# EAGLE design FX-NVBMP_rev_A (EAGLE 9.6.2)
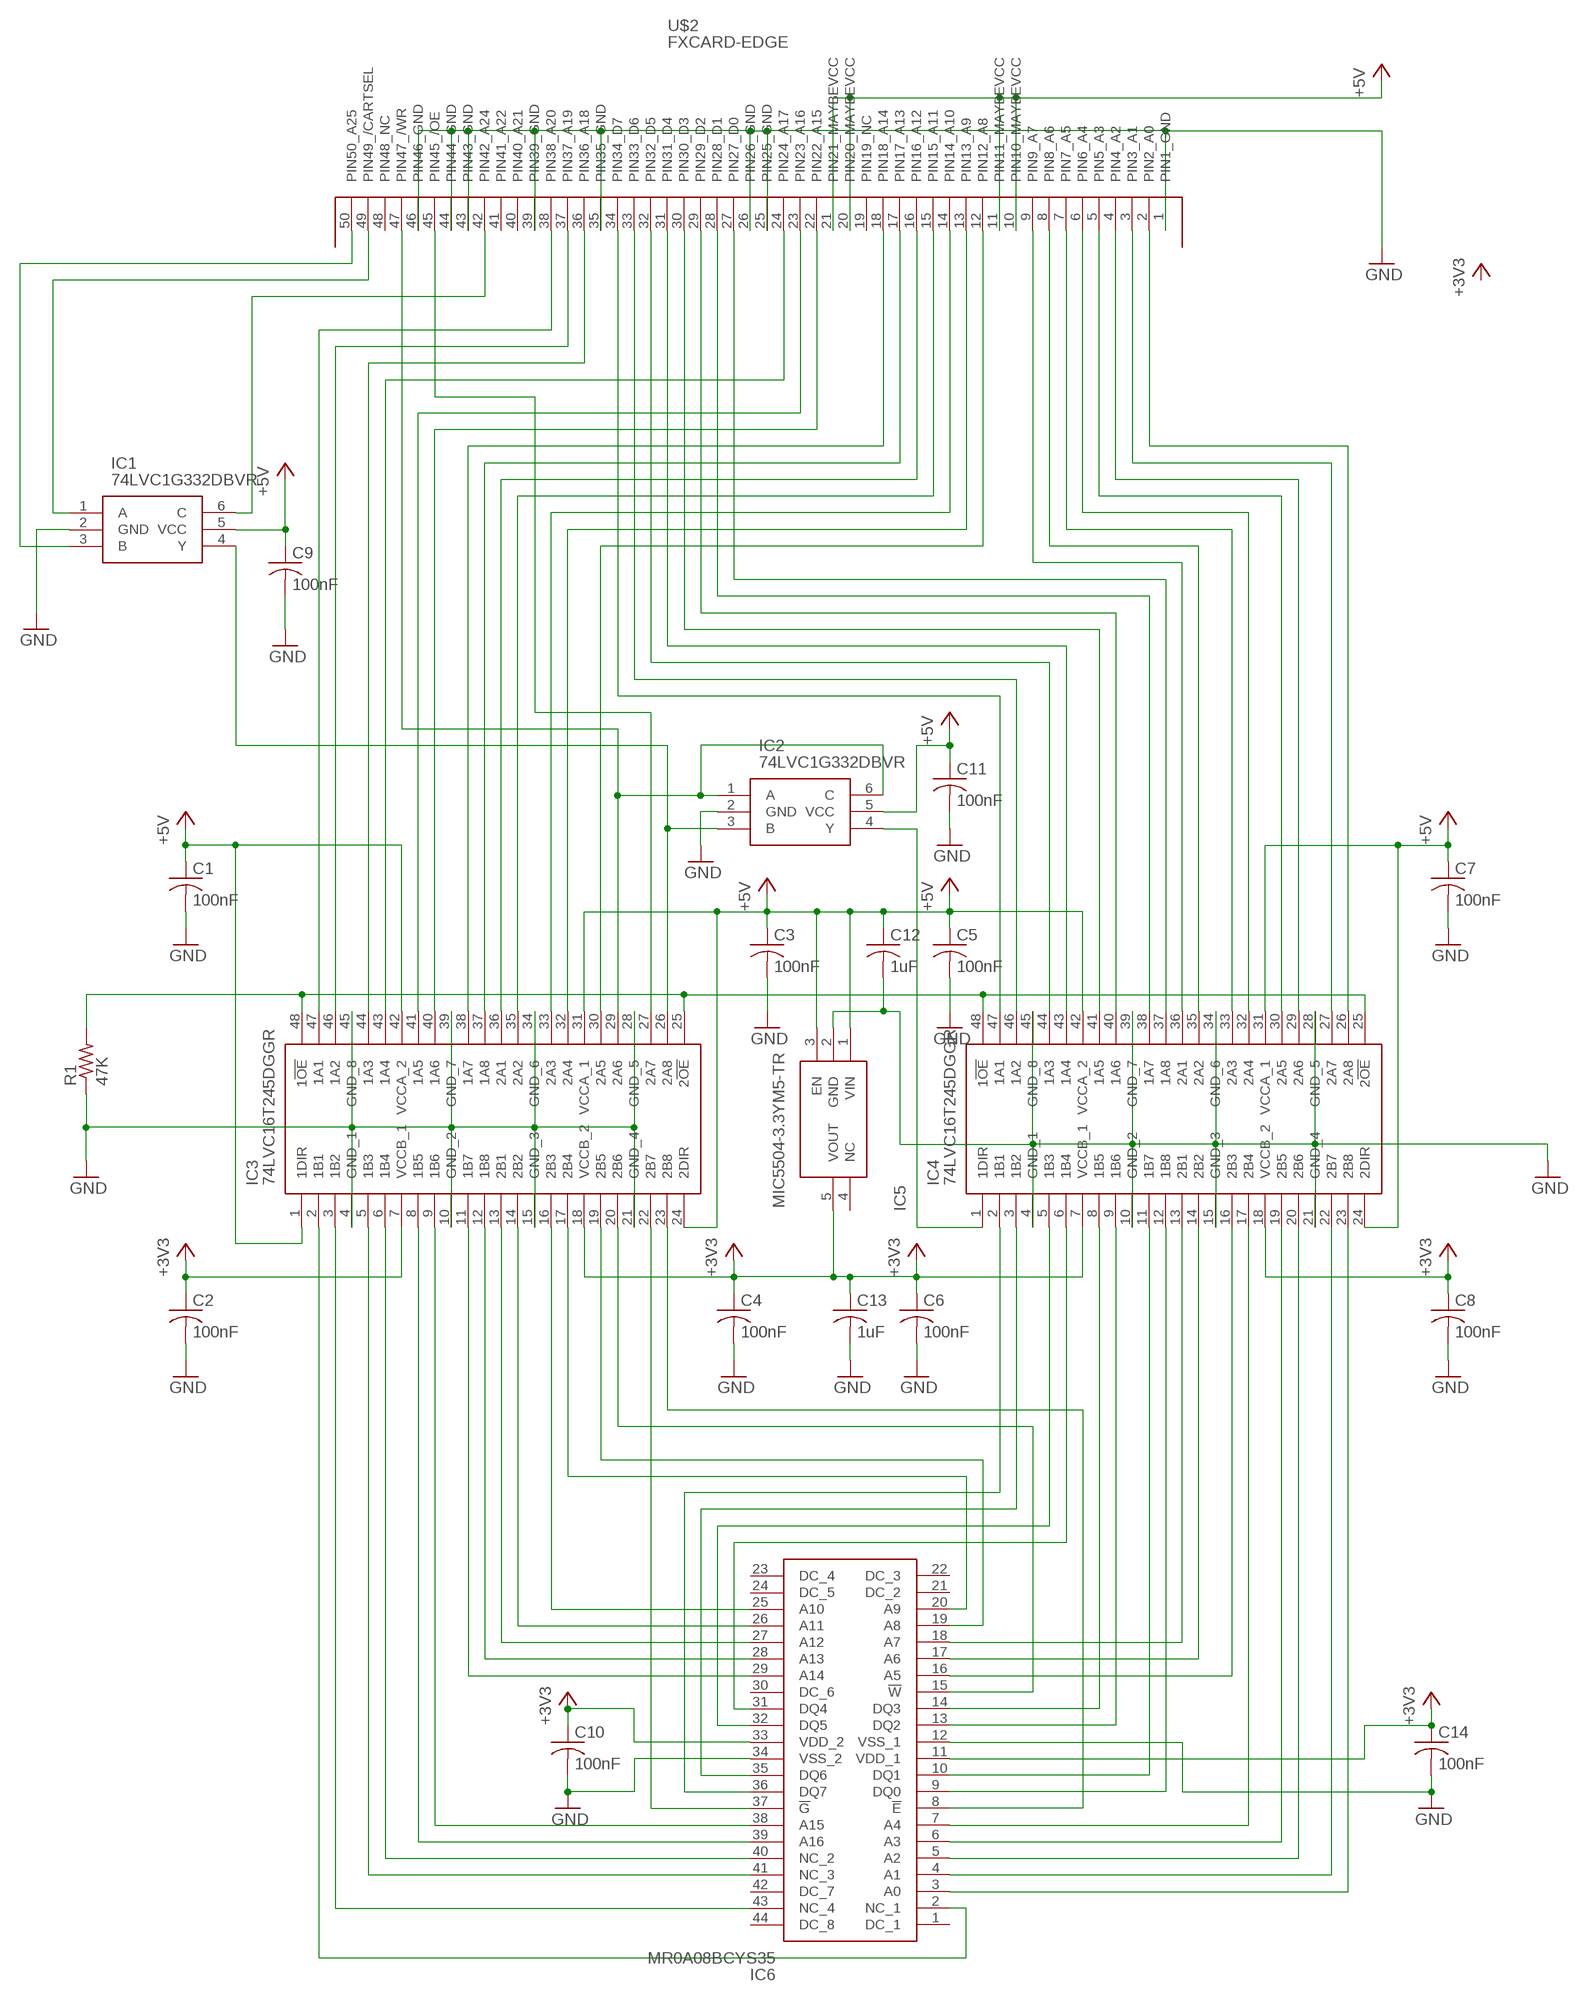
[diagram p0: schematic, sheet 1]

## Parts
C1  100nF  C-USC0402  [C0402]
C2  100nF  C-USC0402  [C0402]
C3  100nF  C-USC0402  [C0402]
C4  100nF  C-USC0402  [C0402]
C5  100nF  C-USC0402  [C0402]
C6  100nF  C-USC0402  [C0402]
C7  100nF  C-USC0402  [C0402]
C8  100nF  C-USC0402  [C0402]
C9  100nF  C-USC0402  [C0402]
C10  100nF  C-USC0402  [C0402]
C11  100nF  C-USC0402  [C0402]
C12  1uF  C-USC0402  [C0402]
C13  1uF  C-USC0402  [C0402]
C14  100nF  C-USC0402  [C0402]
IC1  74LVC1G332DBVR  [SOT95P280X145-6N]
IC2  74LVC1G332DBVR  [SOT95P280X145-6N]
IC3  74LVC16T245DGGR  [SOP50P810X120-48N]
IC4  74LVC16T245DGGR  [SOP50P810X120-48N]
IC5  MIC5504-3.3YM5-TR  [SOT95P280X145-5N]
IC6  MR0A08BCYS35  [SOP80P1176X120-44N]
R1  47K  R-US_R0402  [R0402]
U$2  FXCARD-EDGE  [FXCARD-EDGE]

## Nets
+3V3: C2.1 C4.1 C6.1 C8.1 C10.1 C13.1 C14.1 IC3.7(VCCB_1) IC3.18(VCCB_2) IC4.7(VCCB_1) IC4.18(VCCB_2) IC5.5(VOUT) IC6.11(VDD_1) IC6.33(VDD_2)
+5V: C1.1 C3.1 C5.1 C7.1 C9.1 C11.1 C12.1 IC1.5(VCC) IC2.5(VCC) IC3.1(1DIR) IC3.24(2DIR) IC3.31(VCCA_1) IC3.42(VCCA_2) IC4.24(2DIR) IC4.31(VCCA_1) IC4.42(VCCA_2) IC5.1(VIN) IC5.3(EN) U$2.10(PIN10_MAYBEVCC) U$2.11(PIN11_MAYBEVCC) U$2.20(PIN20_MAYBEVCC) U$2.21(PIN21_MAYBEVCC)
GND: C1.2 C2.2 C3.2 C4.2 C5.2 C6.2 C7.2 C8.2 C9.2 C10.2 C11.2 C12.2 C13.2 C14.2 IC1.2(GND) IC2.2(GND) IC3.4(GND_1) IC3.10(GND_2) IC3.15(GND_3) IC3.21(GND_4) IC3.28(GND_5) IC3.34(GND_6) IC3.39(GND_7) IC3.45(GND_8) IC4.4(GND_1) IC4.10(GND_2) IC4.15(GND_3) IC4.21(GND_4) IC4.28(GND_5) IC4.34(GND_6) IC4.39(GND_7) IC4.45(GND_8) IC5.2(GND) IC6.12(VSS_1) IC6.34(VSS_2) R1.1 U$2.1(PIN1_GND) U$2.25(PIN25_GND) U$2.26(PIN26_GND) U$2.35(PIN35_GND) U$2.39(PIN39_GND) U$2.43(PIN43_GND) U$2.44(PIN44_GND) U$2.46(PIN46_GND)
N$1: IC4.37(1A8) U$2.27(PIN27_D0)
N$2: IC4.38(1A7) U$2.28(PIN28_D1)
N$3: IC4.40(1A6) U$2.29(PIN29_D2)
N$4: IC4.41(1A5) U$2.30(PIN30_D3)
N$5: IC4.43(1A4) U$2.31(PIN31_D4)
N$6: IC4.44(1A3) U$2.32(PIN32_D5)
N$7: IC4.46(1A2) U$2.33(PIN33_D6)
N$8: IC4.47(1A1) U$2.34(PIN34_D7)
N$9: IC4.26(2A8) U$2.2(PIN2_A0)
N$10: IC4.27(2A7) U$2.3(PIN3_A1)
N$11: IC4.29(2A6) U$2.4(PIN4_A2)
N$12: IC4.30(2A5) U$2.5(PIN5_A3)
N$13: IC4.33(2A3) U$2.7(PIN7_A5)
N$14: IC3.43(1A4) U$2.24(PIN24_A17)
N$15: IC4.35(2A2) U$2.8(PIN8_A6)
N$16: IC4.36(2A1) U$2.9(PIN9_A7)
N$17: IC4.32(2A4) U$2.6(PIN6_A4)
N$18: IC3.44(1A3) U$2.36(PIN36_A18)
N$19: IC3.46(1A2) U$2.37(PIN37_A19)
N$20: IC3.47(1A1) U$2.38(PIN38_A20)
N$21: IC1.4(Y) IC2.3(B) IC3.26(2A8)
N$22: IC3.25(2!OE) IC3.48(1!OE) IC4.25(2!OE) IC4.48(1!OE) R1.2
N$23: IC4.23(2B8) IC6.3(A0)
N$24: IC4.22(2B7) IC6.4(A1)
N$25: IC4.20(2B6) IC6.5(A2)
N$26: IC2.4(Y) IC4.1(1DIR)
N$27: IC4.19(2B5) IC6.6(A3)
N$28: IC4.17(2B4) IC6.7(A4)
N$29: IC4.16(2B3) IC6.16(A5)
N$30: IC4.14(2B2) IC6.17(A6)
N$31: IC4.13(2B1) IC6.18(A7)
N$32: IC4.12(1B8) IC6.9(DQ0)
N$33: IC3.30(2A5) U$2.12(PIN12_A8)
N$34: IC3.32(2A4) U$2.13(PIN13_A9)
N$35: IC3.33(2A3) U$2.14(PIN14_A10)
N$36: IC3.35(2A2) U$2.15(PIN15_A11)
N$37: IC3.36(2A1) U$2.16(PIN16_A12)
N$38: IC3.37(1A8) U$2.17(PIN17_A13)
N$39: IC3.38(1A7) U$2.18(PIN18_A14)
N$40: IC3.40(1A6) U$2.22(PIN22_A15)
N$41: IC3.41(1A5) U$2.23(PIN23_A16)
N$42: IC2.1(A) IC2.6(C) IC3.29(2A6) U$2.47(PIN47_/WR)
N$43: IC3.27(2A7) U$2.45(PIN45_/OE)
N$44: IC1.3(B) U$2.50(PIN50_A25)
N$45: IC1.1(A) U$2.49(PIN49_/CARTSEL)
N$46: IC1.6(C) U$2.42(PIN42_A24)
N$47: IC4.11(1B7) IC6.10(DQ1)
N$48: IC4.9(1B6) IC6.13(DQ2)
N$49: IC4.8(1B5) IC6.14(DQ3)
N$50: IC4.6(1B4) IC6.31(DQ4)
N$51: IC4.5(1B3) IC6.32(DQ5)
N$52: IC4.3(1B2) IC6.35(DQ6)
N$53: IC4.2(1B1) IC6.36(DQ7)
N$54: IC3.19(2B5) IC6.19(A8)
N$55: IC3.17(2B4) IC6.20(A9)
N$56: IC3.16(2B3) IC6.25(A10)
N$57: IC3.14(2B2) IC6.26(A11)
N$58: IC3.13(2B1) IC6.27(A12)
N$59: IC3.12(1B8) IC6.28(A13)
N$60: IC3.11(1B7) IC6.29(A14)
N$61: IC3.9(1B6) IC6.38(A15)
N$62: IC3.8(1B5) IC6.39(A16)
N$63: IC3.6(1B4) IC6.40(NC_2)
N$64: IC3.5(1B3) IC6.41(NC_3)
N$65: IC3.3(1B2) IC6.43(NC_4)
N$66: IC3.2(1B1) IC6.2(NC_1)
N$67: IC3.20(2B6) IC6.15(!W)
N$68: IC3.23(2B8) IC6.8(!E)
N$69: IC3.22(2B7) IC6.37(!G)
Unconnected: IC5.4(NC) IC6.1(DC_1) IC6.21(DC_2) IC6.22(DC_3) IC6.23(DC_4) IC6.24(DC_5) IC6.30(DC_6) IC6.42(DC_7) IC6.44(DC_8) U$2.19(PIN19_NC) U$2.40(PIN40_A21) U$2.41(PIN41_A22) U$2.48(PIN48_NC)

## Library data of the parts
C1-C14 = PC-Engine0402:C-US: CAPACITOR, American symbol
IC1 IC2 = PC-Engine:74LVC1G332DBVR: Texas Instruments 74LVC1G332DBVR, 3-Input OR Logic Gate, 1.65 5.5 V, 6-Pin SOT-23 Source: Datasheet <http://www.ti.com/general/docs/suppproductinfo.tsp?distId=26&gotoUrl=http://www.ti.com/lit/gpn/sn74lvc1g332>; DESCRIPTION: Texas Instruments 74LVC1G332DBVR, 3-Input OR Logic Gate, 1.65 5.5 V, 6-Pin SOT-23; HEIGHT: 1.45mm; MANUFACTURER_NAME: Texas Instruments; MANUFACTURER_PART_NUMBER: 74LVC1G332DBVR
IC3 IC4 = PC-Engine:74LVC16T245DGGR: Texas Instruments 74LVC16T245DGGR, Dual, Bus Transceiver, 16-Bit Non-Inverting LVTTL, 1.65 5.5 V, 48-Pin TSSOP Source: Datasheet <https://www.ti.com/lit/ds/symlink/sn74lvc16t245.pdf?ts=1617777001037&ref_url=https%3A%2F%2Fwww.google.com%2F>; DESCRIPTION: Texas Instruments 74LVC16T245DGGR, Dual, Bus Transceiver, 16-Bit Non-Inverting LVTTL, 1.65 5.5 V, 48-Pin TSSOP; HEIGHT: 1.2mm; MANUFACTURER_NAME: Texas Instruments; MANUFACTURER_PART_NUMBER: 74LVC16T245DGGR
IC5 = PC-Engine:MIC5504-3.3YM5-TR: MICROCHIP - MIC5504-3.3YM5-TR - LDO VOLT REG, 0.3A, 3.3V, SOT-23-5 Source: Datasheet <https://componentsearchengine.com/Datasheets/2/MIC5504-3.3YM5-TR.pdf>; ARROW_PART_NUMBER: MIC5504-3.3YM5-TR; ARROW_PRICE-STOCK: https://www.arrow.com/en/products/mic5504-3.3ym5-tr/microchip-technology?region=nac; DESCRIPTION: MICROCHIP - MIC5504-3.3YM5-TR - LDO VOLT REG, 0.3A, 3.3V, SOT-23-5; HEIGHT: 1.45mm; MANUFACTURER_NAME: Microchip; MANUFACTURER_PART_NUMBER: MIC5504-3.3YM5-TR; MOUSER_PART_NUMBER: 998-MIC5504-3.3YM5TR; MOUSER_PRICE-STOCK: https://www.mouser.co.uk/ProductDetail/Microchip-Technology-Atmel/MIC5504-3.3YM5-TR?qs=U6T8BxXiZAUmVQ5Zs217qQ%3D%3D
IC6 = PC-Engine:MR0A08BCYS35: MRAM 1Mb 3.3V 128Kx8 35ns Parallel MRAM Source: Datasheet <https://www.everspin.com/getdatasheet/MR0A08B>; DESCRIPTION: MRAM 1Mb 3.3V 128Kx8 35ns Parallel MRAM; HEIGHT: 1.2mm; MANUFACTURER_NAME: Everspin Tech; MANUFACTURER_PART_NUMBER: MR0A08BCYS35
R1 = PC-Engine0402:R-US_: RESISTOR, American symbol
U$2 = PC-Engine:FXCARD-EDGE

## Board
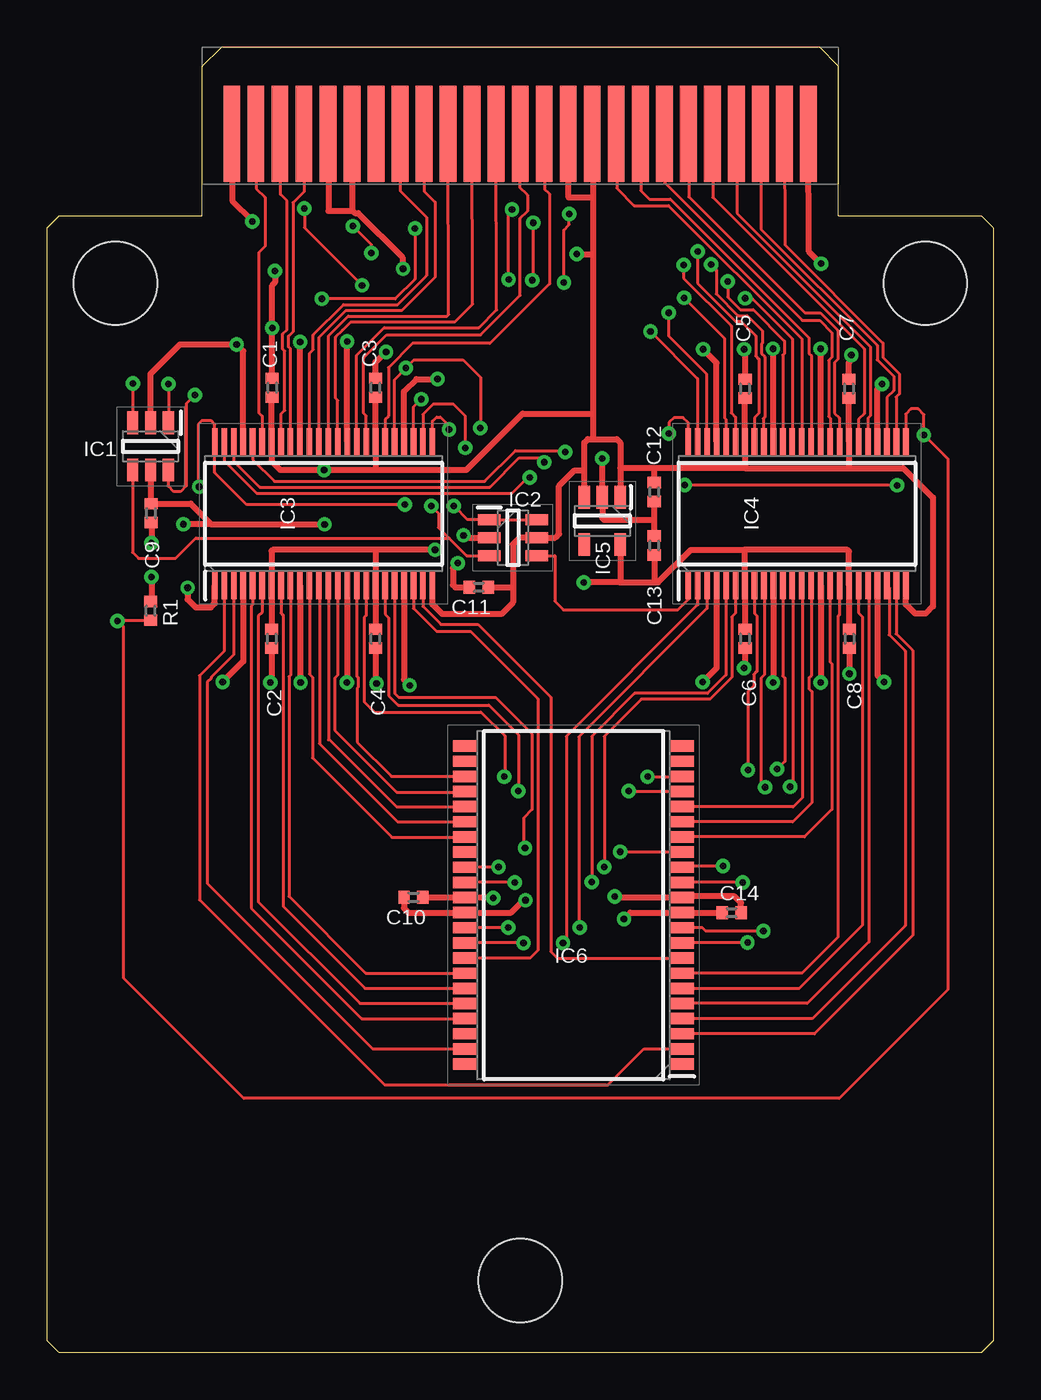
[diagram p1: board, top side]
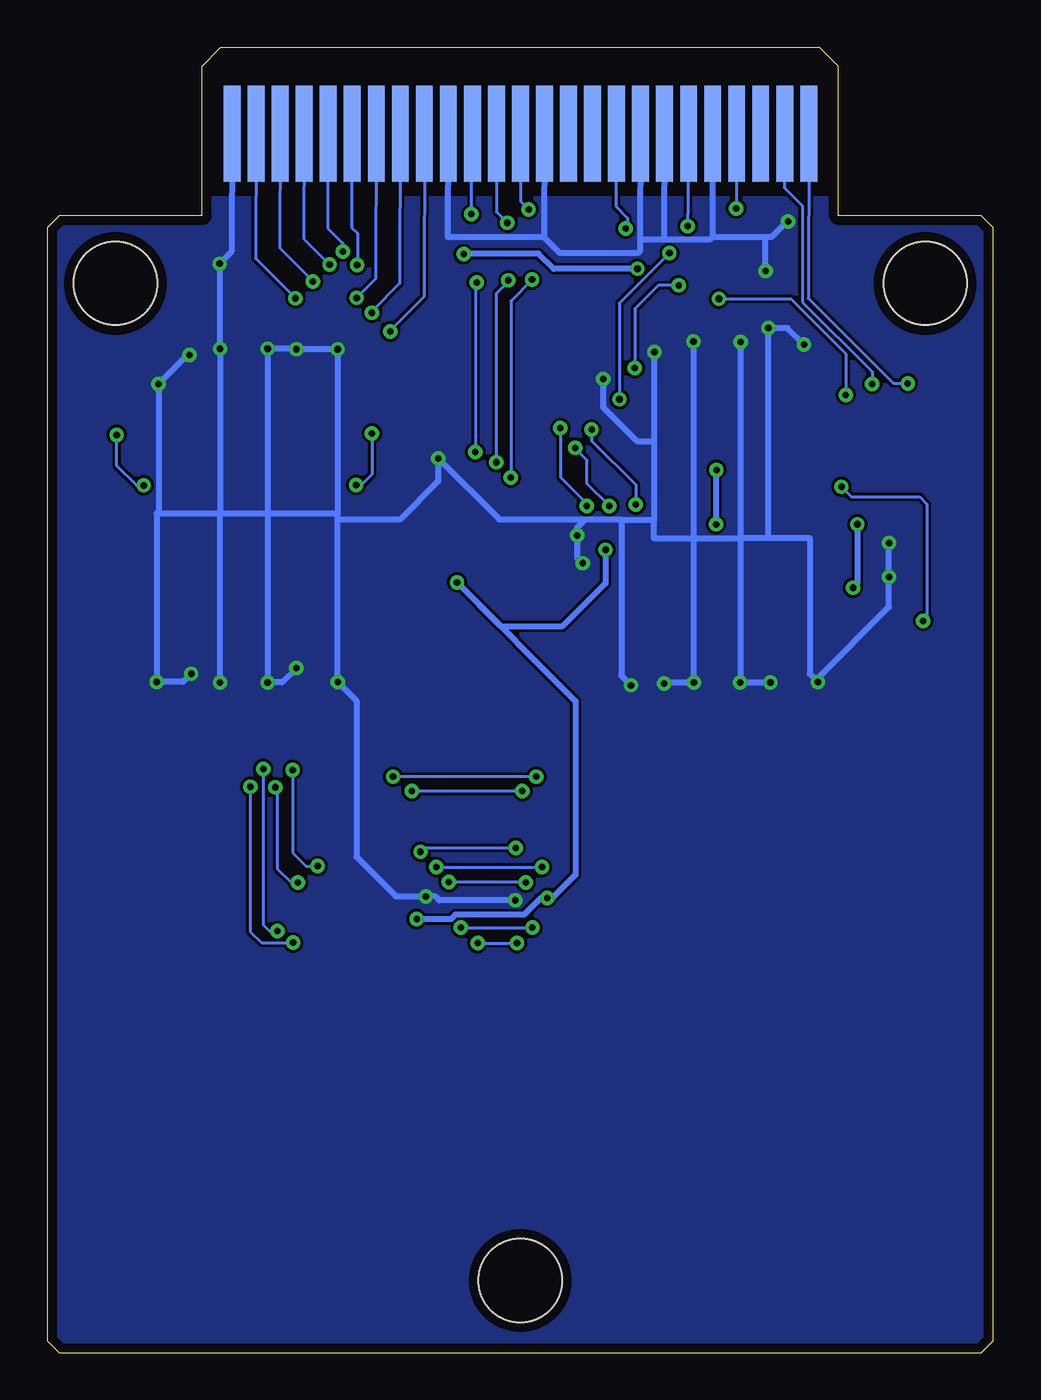
[diagram p2: board, bottom side, seen from below]

Size 50 x 68.96 mm. Coordinates in mm from the lower left corner, seen from the top.
Outline: 49.37,0 0.64,0 0,0.64 0,59.44 0.64,60.07 8.18,60.07 8.18,67.96 9.2,68.96 40.83,68.96 41.81,67.96 41.81,60.07 49.37,60.07 50,59.44 50,0.64 49.37,0
Copper layers (1*16): Top 0.035mm / dielectric 1.5mm / Bottom 0.035mm
Design rules "default *": minimum track width 6mil, minimum drill 0.35mm, track to track 6mil, track to pad 6mil, pad to pad 6mil, via to via 6mil, smd to smd 6mil, copper to edge 20mil, drill to drill 6mil, minimum pad ring 10mil, minimum via ring 8mil, stop-mask expansion 2mil, vias tented up to drill 15mil, thermal gap 10mil
Holes 4.4 mm at 3.6,56.49 46.4,56.49 25,3.81

### Footprints (pad centres in the part's own frame; a part is rotated, then mirrored left to right if it is on the bottom)
C0402 = smd 0.6 x 0.7: 1 -0.5,0; 2 0.5,0
SOT95P280X145-6N = smd 1.2 x 0.6: 1 -1.25,0.95; 2 -1.25,0; 3 -1.25,-0.95; 4 1.25,-0.95; 5 1.25,0; 6 1.25,0.95
SOP50P810X120-48N = smd 1.475 x 0.3: 1 -3.788,5.75; 2 -3.788,5.25; 3 -3.788,4.75; 4 -3.788,4.25; 5 -3.788,3.75; 6 -3.788,3.25; 7 -3.788,2.75; 8 -3.788,2.25; 9 -3.788,1.75; 10 -3.788,1.25; 11 -3.788,0.75; 12 -3.788,0.25; 13 -3.788,-0.25; 14 -3.788,-0.75; 15 -3.788,-1.25; 16 -3.788,-1.75; 17 -3.788,-2.25; 18 -3.788,-2.75; 19 -3.788,-3.25; 20 -3.788,-3.75; 21 -3.788,-4.25; 22 -3.788,-4.75; 23 -3.788,-5.25; 24 -3.788,-5.75; 25 3.788,-5.75; 26 3.788,-5.25; 27 3.788,-4.75; 28 3.788,-4.25; 29 3.788,-3.75; 30 3.788,-3.25; 31 3.788,-2.75; 32 3.788,-2.25; 33 3.788,-1.75; 34 3.788,-1.25; 35 3.788,-0.75; 36 3.788,-0.25; 37 3.788,0.25; 38 3.788,0.75; 39 3.788,1.25; 40 3.788,1.75; 41 3.788,2.25; 42 3.788,2.75; 43 3.788,3.25; 44 3.788,3.75; 45 3.788,4.25; 46 3.788,4.75; 47 3.788,5.25; 48 3.788,5.75
SOT95P280X145-5N = smd 1.2 x 0.6: 1 -1.25,0.95; 2 -1.25,0; 3 -1.25,-0.95; 4 1.25,-0.95; 5 1.25,0.95
SOP80P1176X120-44N = smd 1.295 x 0.6: 1 -5.728,8.4; 2 -5.728,7.6; 3 -5.728,6.8; 4 -5.728,6; 5 -5.728,5.2; 6 -5.728,4.4; 7 -5.728,3.6; 8 -5.728,2.8; 9 -5.728,2; 10 -5.728,1.2; 11 -5.728,0.4; 12 -5.728,-0.4; 13 -5.728,-1.2; 14 -5.728,-2; 15 -5.728,-2.8; 16 -5.728,-3.6; 17 -5.728,-4.4; 18 -5.728,-5.2; 19 -5.728,-6; 20 -5.728,-6.8; 21 -5.728,-7.6; 22 -5.728,-8.4; 23 5.728,-8.4; 24 5.728,-7.6; 25 5.728,-6.8; 26 5.728,-6; 27 5.728,-5.2; 28 5.728,-4.4; 29 5.728,-3.6; 30 5.728,-2.8; 31 5.728,-2; 32 5.728,-1.2; 33 5.728,-0.4; 34 5.728,0.4; 35 5.728,1.2; 36 5.728,2; 37 5.728,2.8; 38 5.728,3.6; 39 5.728,4.4; 40 5.728,5.2; 41 5.728,6; 42 5.728,6.8; 43 5.728,7.6; 44 5.728,8.4
R0402 = smd 0.6 x 0.7: 1 -0.5,0; 2 0.5,0
FXCARD-EDGE = smd 0.889 x 5.08: 1 32.055,-4.572; 2 30.785,-4.572; 3 29.515,-4.572; 4 28.245,-4.572; 5 26.975,-4.572; 6 25.705,-4.572; 7 24.435,-4.572; 8 23.165,-4.572; 9 21.895,-4.572; 10 20.625,-4.572; 11 19.355,-4.572; 12 18.085,-4.572; 13 16.815,-4.572; 14 15.545,-4.572; 15 14.275,-4.572; 16 13.005,-4.572; 17 11.735,-4.572; 18 10.465,-4.572; 19 9.195,-4.572; 20 7.925,-4.572; 21 6.655,-4.572; 22 5.385,-4.572; 23 4.115,-4.572; 24 2.845,-4.572; 25 1.575,-4.572 | smd 0.889 x 5.08 bottom: 26 32.055,-4.572; 27 30.785,-4.572; 28 29.515,-4.572; 29 28.245,-4.572; 30 26.975,-4.572; 31 25.705,-4.572; 32 24.435,-4.572; 33 23.165,-4.572; 34 21.895,-4.572; 35 20.625,-4.572; 36 19.355,-4.572; 37 18.085,-4.572; 38 16.815,-4.572; 39 15.545,-4.572; 40 14.275,-4.572; 41 13.005,-4.572; 42 11.735,-4.572; 43 10.465,-4.572; 44 9.195,-4.572; 45 7.925,-4.572; 46 6.655,-4.572; 47 5.385,-4.572; 48 4.115,-4.572; 49 2.845,-4.572; 50 1.575,-4.572

### Placement (x,y rotation side)
C1  11.89,50.98 90 top
C2  11.86,37.72 270 top
C3  17.35,50.98 90 top
C4  17.35,37.72 270 top
C5  36.88,50.93 90 top
C6  36.88,37.72 270 top
C7  42.37,50.93 90 top
C8  42.39,37.72 270 top
C9  5.49,44.35 270 top
C10  19.35,24.05 180 top
C11  22.81,40.44 180 top
C12  32.08,45.47 270 top
C13  32.08,42.65 90 top
C14  36.17,23.24 0 top
IC1  5.46,47.88 270 top
IC2  24.61,43.05 0 top
IC3  14.61,44.32 90 top
IC4  39.62,44.32 90 top
IC5  29.34,43.94 270 top
IC6  27.81,23.65 180 top
R1  5.46,39.19 270 top
U$2  8.18,68.96 0 top

### Tracks (layer width: path | path; a pad name or v marks a point on that pad's centre or on a via)
+3V3  (via drill 0.35)
  Top 0.305: IC5.5 30.29,40.73 30.25,40.69 | 30.25,40.69 32.08,40.69 | 32.08,40.69 32.28,40.69 34.01,42.42 36.83,42.42 36.84,42.41 | 36.84,42.41 42.3,42.41 42.37,42.34 IC4.18 42.37,38.24 C8.1 | 36.84,42.41 36.87,42.37 IC4.7 C6.1 | v20.5,42.42 17.42,42.42 | 30.25,40.69 v28.35,40.69 | 17.42,42.42 17.36,42.35 IC3.18 C4.1 | 17.42,42.42 11.91,42.42 11.86,42.36 IC3.7 C2.1 | C13.1 32.08,40.69 | v23.57,24.03 23.55,24.05 23.5,24.05 23.49,24.05 IC6.33 C10.1 | v30.48,22.91 30.82,23.25 IC6.11 C14.1
  Bottom 0.305: v20.5,42.42 20.5,40.64 22.76,38.38 26.04,38.38 v28.35,40.69 22.07,34.42 22.07,25.25 23.29,24.03 v23.57,24.03 23.9,24.03 24.79,23.14 28.43,23.14 28.65,22.91 v30.48,22.91
+5V  (via drill 0.35)
  Top 0.305: U$2.10 28.83,61.04 | 28.83,61.04 27.56,61.04 U$2.11 | U$2.21 14.86,60.33 16.13,60.33 | 16.13,60.33 U$2.20 | 17.35,46.63 v14.63,46.63 12.31,46.63 11.86,47.09 IC3.42 11.86,50.45 C1.1 | 17.35,46.63 22.15,46.63 25.12,49.61 28.83,49.61 | 28.73,48.26 28.57,48.26 28.39,48.07 28.39,46.61 | 28.73,48.26 30.1,48.26 30.29,48.07 30.29,46.74 | 36.87,46.74 IC4.42 C5.1 | 36.87,46.74 32.08,46.74 | 32.08,46.74 30.29,46.74 | IC5.3 28.39,46.61 | 42.37,46.74 IC4.31 C7.1 | 30.29,46.74 IC5.1 | 36.87,46.74 42.37,46.74 | IC4.24 45.37,39.54 45.87,39.04 46.43,39.04 46.81,39.42 46.81,45.19 46.79,45.19 45.24,46.74 42.37,46.74 | 28.83,61.04 28.83,58.09 | 28.83,58.09 28.83,49.61 | 28.83,49.61 28.83,48.36 28.73,48.26 | C3.1 IC3.31 17.36,46.64 17.35,46.63 | IC1.5 5.46,44.87 C9.1 7.58,44.85 8.66,43.76 | 16.13,60.33 16.26,60.2 16.44,60.2 18.77,57.86 18.77,57.3 v18.81,57.26 | v27.99,58.04 28.78,58.04 28.83,58.09 | 8.66,43.76 v14.66,43.76 | 28.39,46.61 27.86,46.61 27.05,45.8 27.05,43.26 26.85,43.05 IC2.5 24.97,43.05 24.61,42.7 24.61,40.44 | C12.1 32.08,46.74 | IC3.24 20.36,39.54 20.88,39.01 24,39.01 24.61,39.62 24.61,40.44 | 8.66,43.76 7.37,43.76 v7.19,43.76 | v7.42,40.41 7.42,39.8 7.85,39.37 8.64,39.37 8.86,39.59 IC3.1 | C11.1 24.61,40.44
  Bottom 0.305: v18.81,57.26 23.23,57.26 24.03,58.06 27.96,58.06 v27.99,58.04 | v14.66,43.76 14.66,46.61 v14.63,46.63 | v7.19,43.76 7.19,40.64 v7.42,40.41
GND  (via drill 0.35)
  Top 0.305: v40.89,57.53 40.26,58.17 U$2.1 | U$2.25 9.78,60.86 10.85,59.79 v10.85,59.77 | v29.34,47.24 IC5.2 29.34,44.09 29.44,43.99 32.08,43.99 | IC4.21 43.87,35.78 v44.22,35.43 | IC4.15 v40.87,35.41 | IC4.45 35.37,52.29 v34.66,53.01 | IC4.39 38.37,53.02 v38.35,53.03 | IC4.34 v40.87,53.03 | IC4.28 43.87,50.94 v44.12,51.18 | IC4.4 35.37,36.17 34.65,35.44 34.64,35.44 v34.65,35.43 | IC4.10 38.37,35.43 v38.35,35.41 | C7.2 42.37,52.32 42.52,52.48 42.52,52.68 v42.49,52.7 | v36.83,53.01 36.88,52.96 C5.2 | v36.83,36.17 36.88,36.22 C6.2 | C8.2 v42.39,35.87 | IC3.28 18.86,50.78 19.51,51.44 v20.62,51.44 | IC3.21 18.86,35.55 v19.15,35.26 | IC3.15 15.86,35.44 v15.82,35.41 | IC3.34 v15.86,53.41 v15.85,53.42 | IC3.39 v13.36,53.38 v13.36,53.39 | IC3.10 13.36,35.44 v13.39,35.41 | IC3.4 10.36,36.52 v9.27,35.43 | IC3.45 10.36,52.92 v10.01,53.26 7.01,53.26 5.46,51.71 IC1.2 | C3.2 17.35,52.32 17.88,52.86 v17.91,52.86 | C1.2 v11.89,54.13 11.89,56.39 12.04,56.54 v12.04,57.13 v12.03,57.15 | v22,43.18 22.12,43.05 IC2.2 | C13.2 32.08,43.99 | 32.08,43.99 C12.2 | v25.27,23.9 25.17,23.9 24.52,23.25 IC6.34 19.09,23.25 18.86,23.49 C10.2 | v30,24.11 30.05,24.05 IC6.12 33.6,24.11 36.32,24.11 36.67,23.76 C14.2 | C2.2 11.86,35.41 v11.78,35.41 | C4.2 17.35,35.41 v17.4,35.36 | C9.2 5.51,43.82 v5.51,42.77 | v5.51,40.97 5.51,39.74 R1.1 | v21.69,41.71 21.44,41.45 21.44,40.56 21.57,40.44 C11.2
  Bottom 0.305: U$2.39 23.75,58.93 | 23.75,58.93 28.83,58.93 U$2.35 | U$2.44 17.4,58.93 | 17.4,58.93 17.4,58.8 18.67,58.8 | U$2.43 18.67,58.8 | U$2.46 14.86,58.93 | 14.86,58.93 14.99,58.8 17.27,58.8 17.4,58.93 | U$2.1 40.26,58.17 v40.89,57.53 40.87,57.51 v40.87,53.03 40.87,44.32 | 38.38,44.32 38.35,44.32 v38.35,53.03 36.85,53.03 v36.83,53.01 v34.66,53.01 34.66,44.32 34.65,44.31 | 38.38,44.32 40.87,44.32 | 40.87,44.32 44.12,44.32 | 44.12,44.32 44.22,44.32 v44.22,35.43 42.82,35.43 v42.39,35.87 | 44.12,44.32 v44.12,51.18 42.55,52.76 v42.49,52.7 | 38.37,44.31 38.38,44.32 | v40.87,35.41 40.87,44.32 | 38.37,44.31 38.37,35.42 v38.35,35.41 37.59,35.41 v36.83,36.17 | 34.65,44.01 31.36,44.01 29.34,46.02 v29.34,47.24 26.11,44.02 21.57,44.02 | 34.65,44.31 38.37,44.31 | 34.65,44.01 v34.65,35.43 33.66,34.44 33.66,26.19 31.57,24.11 v30,24.11 29.49,24.11 29.29,23.9 v25.27,23.9 | 34.65,44.01 34.65,44.31 | 21.57,44.02 19.66,44.02 19.66,43.99 | 19.66,43.99 17.96,43.99 | 17.96,43.99 17.93,43.99 17.93,48.18 | 15.85,43.03 17.96,43.03 17.96,43.99 | 15.85,43.03 15.82,43.03 | 15.82,43.03 13.36,43.03 | 19.66,43.99 19.66,35.76 v19.15,35.26 | 15.82,43.03 v15.82,35.41 17.35,35.41 v17.4,35.36 | v15.85,53.42 15.85,43.03 | v13.36,53.39 13.36,43.03 | 13.36,43.03 13.36,35.43 v13.39,35.41 v11.78,35.41 | 11.91,43.03 9.7,43.03 9.7,35.87 v9.27,35.43 9.27,35.64 5.51,39.4 v5.51,40.97 v5.51,42.77 | 11.91,43.03 13.36,43.03 | v17.91,52.86 17.93,52.83 17.93,48.18 | v20.62,51.44 20.62,49.94 18.85,48.16 17.96,48.16 17.93,48.18 | 11.91,43.03 11.91,54.1 v11.89,54.13 10.87,54.13 v10.01,53.26 | 21.57,44.02 22,43.59 v22,43.18 22,41.96 21.75,41.71 v21.69,41.71
  Bottom 0.305: 18.67,58.8 18.67,58.19 18.77,58.09 22.91,58.09 23.75,58.93 | v10.85,59.77 10.9,59.77 11.73,58.93 12.04,58.93 | 12.04,58.93 14.86,58.93 | v12.03,57.15 12.04,57.15 12.04,58.93
  pour Bottom: -0.36,-0.2 -0.36,60.45 -0.84,60.93 50.14,60.93 50.55,60.53 50.55,0 50.44,-0.1 -0.25,-0.1
N$1  (via drill 0.35)
  Top 0.152: v36.88,55.7 37.23,55.7 39.37,53.56 IC4.37
  Bottom 0.152: U$2.27 38.99,57.81 v36.88,55.7
N$2  (via drill 0.35)
  Top 0.152: v35.97,56.59 35.97,55.76 36.63,55.1 37.31,55.1 38.96,53.44 38.96,52.78 38.87,52.7 IC4.38
  Bottom 0.152: U$2.28 37.72,58.37 35.97,56.62 v35.97,56.59
N$3  (via drill 0.35)
  Top 0.152: v35.08,57.48 35.36,57.2 35.36,55.94 36.51,54.79 37,54.79 37.8,54 37.8,53.34 37.75,53.29 37.75,52.78 37.92,52.61 37.92,49.43 37.85,49.35 37.85,48.14 IC4.40
  Bottom 0.152: U$2.29 36.45,58.85 v35.08,57.48
N$4  (via drill 0.35)
  Top 0.152: IC4.41 37.37,49.39 37.62,49.63 37.62,52.48 37.44,52.66 37.44,53.72 36.67,54.49 36.38,54.49 34.37,56.5 34.37,58.17 v34.38,58.18
  Bottom 0.152: U$2.30 35.18,59.41 34.38,58.61 v34.38,58.18
N$5  (via drill 0.35)
  Top 0.152: v33.63,57.45 33.63,56.77 36.15,54.25 36.15,49.65 36.37,49.43 IC4.43
  Bottom 0.152: U$2.31 33.91,59.44 33.6,59.13 33.6,57.61 33.63,57.58 v33.63,57.45
N$6  (via drill 0.35)
  Top 0.152: v33.66,55.73 35.8,53.59 35.8,49.38 35.87,49.3 IC4.44
  Bottom 0.152: U$2.32 32.64,56.74 v33.66,55.73
N$7  (via drill 0.35)
  Top 0.152: v32.84,54.94 32.84,53.72 34.85,51.71 34.85,48.14 IC4.46
  Bottom 0.152: U$2.33 31.37,56.49 32.87,54.99 32.87,54.97 v32.84,54.94
N$8  (via drill 0.35)
  Top 0.152: v31.88,53.95 34.37,51.45 IC4.47
  Bottom 0.152: U$2.34 30.1,55.78 31.88,54 v31.88,53.95
N$9
  Top 0.152: IC4.26 44.87,50.49 45.03,50.66 45.03,51.71 44.17,52.58 44.17,53.34 38.99,58.52 U$2.2
N$10
  Top 0.152: U$2.3 37.72,59.36 43.87,53.21 43.87,52.45 44.73,51.59 44.73,50.83 44.37,50.47 IC4.27 | IC4.27
N$11
  Top 0.152: U$2.4 36.45,60.2 43.49,53.16 43.49,49.49 43.37,49.37 IC4.29
N$12
  Top 0.152: U$2.5 35.18,61.04 43.18,53.04 43.18,49.61 42.87,49.3 IC4.30
N$13
  Top 0.152: U$2.7 32.64,61.8 39.9,54.53 40.82,54.53 41.48,53.88 41.48,52.6 41.3,52.43 41.3,49.45 41.38,49.38 IC4.33
N$14
  Top 0.152: U$2.24 11.05,61.49 11.51,61.04 11.51,58.44 11.18,58.12 11.18,49.66 11.36,49.48 IC3.43
N$15
  Top 0.152: U$2.8 31.37,61.39 31.81,60.95 32.93,60.95 40.26,53.62 40.26,52.78 40.37,52.67 IC4.35
N$16
  Top 0.152: U$2.9 30.1,61.52 31.01,60.6 32.84,60.6 39.88,53.57 IC4.36
N$17
  Top 0.152: U$2.6 33.91,61.06 40.04,54.93 40.86,54.93 41.78,54.01 41.78,52.47 41.6,52.3 41.6,49.63 41.85,49.38 41.85,48.13 IC4.32
N$18  (via drill 0.35)
  Top 0.152: IC3.44 10.86,47.18 12.01,46.02 23.11,46.02 24.74,47.65 27.36,47.65 27.38,47.62 v27.38,47.58 | v27.3,56.54 27.3,59.31 27.58,59.59 v27.58,60.15
  Bottom 0.152: v27.38,47.58 27.36,47.6 27.36,56.49 v27.3,56.54 | v27.58,60.15 27.58,64.36 U$2.36
N$19  (via drill 0.35)
  Top 0.152: IC3.46 9.85,48.1 9.85,47.1 11.23,45.72 23.39,45.72 24.94,47.27 26.04,47.27 v26.26,47.04 | v25.63,56.66 25.68,56.7 v25.68,59.69
  Bottom 0.152: v26.26,47.04 26.26,55.96 25.63,56.59 v25.63,56.66 | v25.68,59.69 26.26,60.27 U$2.37
N$20  (via drill 0.35)
  Top 0.152: IC3.47 9.35,47.13 11.06,45.41 24.56,45.41 25.38,46.23 v25.5,46.23 | v24.38,56.69 24.38,60.4 v24.56,60.4
  Bottom 0.152: v25.5,46.23 25.5,55.55 24.38,56.67 v24.38,56.69 | v24.56,60.4 24.97,60.81 24.97,64.34 U$2.38
N$21  (via drill 0.35)
  Top 0.152: IC1.4 4.51,42.28 4.83,41.96 6.78,41.96 7.85,43.03 21.23,43.03 | 21.23,43.03 20.68,43.59 20.68,44.35 v20.3,44.73 | 21.23,43.03 22.16,42.1 IC2.3 | v22.1,47.8 22.1,49.48 21.46,50.11 20.4,50.11 19.86,49.57 IC3.26
  Bottom 0.152: v20.3,44.73 21.46,45.9 21.46,47.14 22.1,47.78 v22.1,47.8
N$22  (via drill 0.35)
  Top 0.152: IC3.25 20.36,49.21 20.57,49.43 20.78,49.43 21.23,48.97 v21.23,48.77 | v18.9,44.81 10.54,44.81 8.86,46.49 IC3.48 8.86,49.03 8.66,49.23 8.15,49.23 7.98,49.05 7.98,45.8 v8.03,45.74 | IC4.48 33.87,49.13 33.6,49.4 33.12,49.4 32.87,49.15 32.87,48.59 v32.84,48.56 | v44.91,45.82 44.88,45.85 v33.68,45.85 | IC4.25 45.36,48.12 45.36,49.58 45.64,49.86 46.02,49.86 46.33,49.55 v46.33,48.49 47.6,47.22 47.6,19.18 41.86,13.44 10.39,13.44 4.01,19.81 4.01,38.35 v3.71,38.66 3.74,38.69 R1.2
  Bottom 0.152: v21.23,48.77 21.23,48.18 18.9,45.85 v18.9,44.81 | v8.03,45.74 7.49,45.21 3.89,45.21 3.5,44.83 3.5,38.86 v3.71,38.66 | v32.84,48.56 32.84,46.41 33.4,45.85 v33.68,45.85 | v44.91,45.82 45.29,45.82 46.33,46.86 v46.33,48.49
N$23
  Top 0.152: IC4.23 44.87,37.97 45.74,37.11 45.74,22.04 40.55,16.85 IC6.3
N$24
  Top 0.152: IC4.22 44.49,40.41 44.49,37.92 45.34,37.07 45.34,22.55 40.43,17.65 IC6.4
N$25
  Top 0.152: IC4.20 43.42,40.48 43.42,21.71 40.16,18.45 IC6.5
N$26
  Top 0.152: IC2.4 26.82,42.1 26.82,39.7 27.28,39.24 33.33,39.24 33.87,39.79 IC4.1
N$27
  Top 0.152: IC4.19 42.87,39.09 43.08,38.89 43.08,22.58 39.73,19.23 33.56,19.23 IC6.6
N$28
  Top 0.152: IC4.17 41.87,38.98 41.79,38.89 41.79,21.95 39.88,20.05 IC6.7
N$29
  Top 0.152: IC4.16 41.37,36.5 41.48,36.4 41.48,28.7 40.02,27.25 IC6.16
N$30
  Top 0.152: IC4.14 40.37,35.77 40.26,35.66 40.26,35.08 40.41,34.92 40.41,29.06 39.4,28.04 IC6.17
N$31
  Top 0.152: IC4.13 39.9,40.51 39.9,29.31 39.42,28.83 33.56,28.83 IC6.18
N$32  (via drill 0.35)
  Top 0.152: v39.27,29.9 39.4,30.03 39.4,40.51 IC4.12 | v37.01,21.67 33.56,21.67 IC6.9
  Bottom 0.152: v39.27,29.9 39.27,22.25 38.68,21.67 v37.01,21.67
N$33
  Top 0.152: U$2.12 26.29,61.47 26.54,61.21 26.54,56.46 23.39,53.31 19.3,53.31 18.03,52.05 18.03,49.48 17.86,49.3 IC3.30
N$34
  Top 0.152: IC3.32 16.86,49.49 16.72,49.63 16.72,52.56 17.93,53.77 22.91,53.77 24.99,55.85 24.99,59.92 25.38,60.3 25.38,61.16 24.97,61.57 24.97,64.34 U$2.13
N$35
  Top 0.152: IC3.33 16.36,52.7 17.81,54.15 22.81,54.15 23.75,55.09 U$2.14
N$36
  Top 0.152: IC3.35 15.36,50.31 15.24,50.42 15.24,53.67 15.6,54.02 15.62,54.02 16.05,54.46 21.54,54.46 22.48,55.4 U$2.15
N$37
  Top 0.152: IC3.36 14.86,53.71 15.91,54.76 21.13,54.76 21.21,54.84 U$2.16
N$38
  Top 0.152: IC3.37 14.36,53.64 15.78,55.07 18.75,55.07 20.5,56.82 20.5,60.78 19.94,61.34 U$2.17
N$39
  Top 0.152: IC3.38 13.86,52.79 14.05,52.99 14.05,53.77 15.65,55.37 18.52,55.37 20.04,56.9 20.04,59.99 18.67,61.37 U$2.18
N$40
  Top 0.152: IC3.40 12.86,53.04 12.75,53.14 12.75,53.7 12.98,53.92 12.98,60.76 13.59,61.37 U$2.22
N$41
  Top 0.152: IC3.41 12.36,49.59 12.55,49.78 12.55,52.91 12.45,53.01 12.45,53.83 12.66,54.04 12.66,60.84 12.32,61.19 U$2.23
N$42  (via drill 0.35)
  Top 0.152: v21.49,44.73 22.21,44 IC2.1 IC2.6 | v22.89,48.84 22.89,51.54 21.97,52.45 19.38,52.45 v18.95,52.02 18.95,51.99 18.36,51.4 IC3.29 | v13.59,60.45 13.59,59.44 v16.64,56.39
  Bottom 0.152: v22.89,48.84 22.89,46.25 21.49,44.86 v21.49,44.73 | v18.95,52.02 18.95,55.14 17.7,56.39 v16.64,56.39 | U$2.47 v13.59,60.45
N$43  (via drill 0.35)
  Top 0.152: v16.15,59.51 17.12,58.55 v17.12,58.09 | IC3.27 | v19.76,50.37 19.36,49.96 IC3.27
  Bottom 0.152: U$2.45 16.13,60.15 16.15,60.12 v16.15,59.51 | v17.12,58.09 19.76,55.45 v19.76,50.37
N$44  (via drill 0.35)
  Top 0.152: v4.52,51.21 IC1.3
  Bottom 0.152: U$2.50 9.78,55.7 5.28,51.21 v4.52,51.21
N$45  (via drill 0.35)
  Top 0.152: v6.4,51.18 v6.41,51.17 IC1.1
  Bottom 0.152: U$2.49 11.05,61.54 10.08,60.58 10.08,55.5 6.4,51.82 v6.4,51.18
N$46  (via drill 0.35)
  Top 0.152: v19.43,59.38 19.43,56.72 18.39,55.68 v14.5,55.68 | v7.8,50.6 7.34,50.14 7.34,45.8 7.04,45.49 6.68,45.49 6.41,45.76 IC1.6
  Bottom 0.152: U$2.42 19.94,60.55 19.33,59.94 19.33,59.49 v19.43,59.38 | v14.5,55.68 10.69,55.68 7.8,52.78 v7.8,50.6
N$47  (via drill 0.35)
  Top 0.152: IC4.11 38.87,35.75 38.99,35.63 38.99,31.24 v38.58,30.84 | v37.85,22.27 34.8,22.27 34.63,22.45 IC6.10
  Bottom 0.152: v38.58,30.84 38.58,22.61 38.25,22.27 v37.85,22.27
N$48  (via drill 0.35)
  Top 0.152: IC4.9 37.9,40.51 37.9,35.81 37.72,35.63 37.72,30.1 v37.95,29.87 | v36.75,24.84 IC6.13
  Bottom 0.152: v37.95,29.87 37.85,29.77 37.85,25.58 37.11,24.84 v36.75,24.84
N$49  (via drill 0.35)
  Top 0.152: IC4.8 37.37,39.05 37.51,38.92 37.51,35.99 37.34,35.82 37.34,35.23 37.03,34.92 v37.03,30.79 | v35.71,25.7 33.6,25.7 IC6.14
  Bottom 0.152: v37.03,30.79 37.03,26.42 36.32,25.7 v35.71,25.7
N$50  (via drill 0.35)
  Top 0.152: IC4.6 36.37,39.07 36.18,38.87 36.18,35.68 35.02,34.52 31.4,34.52 29.44,32.56 v29.44,25.65 | v23.85,25.65 IC6.31
  Bottom 0.152: v29.44,25.65 v23.85,25.65
N$51  (via drill 0.35)
  Top 0.152: IC4.5 35.87,35.8 34.9,34.83 31.04,34.83 28.78,32.56 v28.78,24.87 | v24.71,24.84 IC6.32
  Bottom 0.152: v28.78,24.87 24.74,24.87 v24.71,24.84
N$52  (via drill 0.35)
  Top 0.152: IC4.3 34.87,39.32 28.09,32.54 28.09,22.5 v28.14,22.45 | v24.36,22.45 v24.35,22.45 IC6.35
  Bottom 0.152: v28.14,22.45 v24.36,22.45
N$53  (via drill 0.35)
  Top 0.152: IC4.2 34.37,39.51 27.43,32.56 27.43,21.82 v27.25,21.64 | v25.17,21.64 v25.16,21.65 IC6.36
  Bottom 0.152: v27.25,21.64 v25.17,21.64
N$54  (via drill 0.35)
  Top 0.152: IC3.19 17.86,39.02 18.05,38.82 18.05,34.71 18.54,34.21 23.34,34.21 24.92,32.64 24.92,29.69 v24.89,29.67 | v30.73,29.67 33.52,29.67 IC6.19
  Bottom 0.152: v24.89,29.67 v30.73,29.67
N$55  (via drill 0.35)
  Top 0.152: IC3.17 16.86,38.95 16.74,38.84 16.74,34.39 17.29,33.85 22.92,33.85 24.18,32.59 24.18,30.45 v24.16,30.43 | v31.73,30.43 33.52,30.43 IC6.20
  Bottom 0.152: v24.16,30.43 v31.73,30.43
N$56
  Top 0.152: IC3.16 16.36,35.73 16.43,35.66 16.43,35.16 16.38,35.11 16.38,32.26 18.19,30.45 IC6.25
N$57
  Top 0.152: IC3.14 15.36,35.8 15.19,35.63 15.19,32.89 18.47,29.62 22.05,29.62 IC6.26
N$58
  Top 0.152: IC3.13 14.86,32.36 14.9,32.4 18.45,28.85 IC6.27
N$59
  Top 0.152: IC3.12 14.38,40.51 14.38,32.18 18.52,28.04 IC6.28
N$60
  Top 0.152: IC3.11 13.86,35.85 14.02,35.68 14.02,31.42 18.21,27.23 22.07,27.23 IC6.29
N$61
  Top 0.152: IC3.9 12.86,35.79 12.78,35.71 12.78,24.1 16.83,20.05 IC6.38
N$62
  Top 0.152: IC3.8 12.36,39.08 12.47,38.97 12.47,23.58 16.8,19.25 IC6.39
N$63
  Top 0.152: IC3.6 11.36,39.12 11.16,38.92 11.16,23.82 16.53,18.45 IC6.40
N$64
  Top 0.152: IC3.5 10.86,39.52 10.78,39.44 10.78,23.49 16.62,17.65 IC6.41
N$65
  Top 0.152: IC3.3 9.86,36.88 8.66,35.68 8.66,35.64 8.46,35.43 8.46,24.79 17.2,16.05 IC6.43
N$66
  Top 0.152: IC3.2 9.36,37.07 8.05,35.76 8.05,23.93 17.83,14.15 29.64,14.15 31.54,16.05 IC6.2
N$67  (via drill 0.35)
  Top 0.152: IC3.20 18.36,34.83 18.57,34.62 23.7,34.62 25.63,32.69 25.63,28.7 25.17,28.25 25.17,26.75 v25.25,26.67 | v30.28,26.47 33.52,26.47 IC6.15
  Bottom 0.152: v25.25,26.67 30.07,26.67 v30.28,26.47
N$68
  Top 0.152: IC3.23 19.86,40.11 19.85,40.11 19.85,39.43 20.8,38.48 22.76,38.48 26.62,34.62 26.62,21.18 26.95,20.85 IC6.8
N$69
  Top 0.152: IC3.22 19.36,39.32 20.57,38.1 22.38,38.1 25.93,34.54 25.93,21.26 25.52,20.85 IC6.37

### Text on the board
tValues: 25 | 1 | FX-NVBMP | Board Rev. A | Top | Prototype by / David Shadoff / (c) 2022 | Bottom
bValues: 50 | 26 | JLCJLCJLCJLC